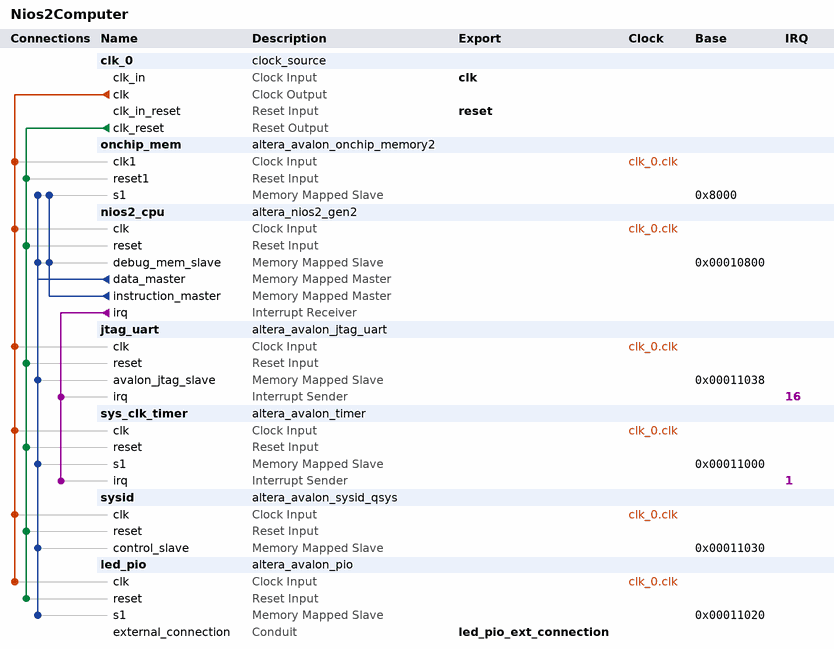
[diagram p0: system contents]
# Platform Designer (Qsys) system Nios2Computer, Cyclone V 5CSEMA4U23C6
# Parameters at their usual value, and those the tool derives, are not listed.
package require -exact qsys 18.1
create_system Nios2Computer
set_project_property DEVICE_FAMILY {Cyclone V}
set_project_property DEVICE 5CSEMA4U23C6

add_instance clk_0 clock_source 18.1
set_instance_parameter_value clk_0 clockFrequency 50000000

add_instance onchip_mem altera_avalon_onchip_memory2 18.1
set_instance_parameter_value onchip_mem dataWidth 32
set_instance_parameter_value onchip_mem dualPort false
set_instance_parameter_value onchip_mem initMemContent true
set_instance_parameter_value onchip_mem initializationFileName onchip_mem.hex
set_instance_parameter_value onchip_mem memorySize 20480

add_instance nios2_cpu altera_nios2_gen2 18.1
set_instance_parameter_value nios2_cpu dcache_size 2048
set_instance_parameter_value nios2_cpu exceptionSlave onchip_mem.s1
set_instance_parameter_value nios2_cpu icache_size 2048
set_instance_parameter_value nios2_cpu impl Fast
set_instance_parameter_value nios2_cpu resetSlave onchip_mem.s1

add_instance jtag_uart altera_avalon_jtag_uart 18.1
set_instance_parameter_value jtag_uart simInteractiveOptions NO_INTERACTIVE_WINDOWS

add_instance sys_clk_timer altera_avalon_timer 18.1
set_instance_parameter_value sys_clk_timer period 1
set_instance_parameter_value sys_clk_timer periodUnits MSEC

add_instance sysid altera_avalon_sysid_qsys 18.1
set_instance_parameter_value sysid id 0

add_instance led_pio altera_avalon_pio 18.1
set_instance_parameter_value led_pio direction Output
set_instance_parameter_value led_pio width 8

# connections
add_connection clk_0.clk jtag_uart.clk clock
add_connection clk_0.clk led_pio.clk clock
add_connection clk_0.clk nios2_cpu.clk clock
add_connection clk_0.clk onchip_mem.clk1 clock
add_connection clk_0.clk sys_clk_timer.clk clock
add_connection clk_0.clk sysid.clk clock
add_connection clk_0.clk_reset jtag_uart.reset reset
add_connection clk_0.clk_reset led_pio.reset reset
add_connection clk_0.clk_reset nios2_cpu.reset reset
add_connection clk_0.clk_reset onchip_mem.reset1 reset
add_connection clk_0.clk_reset sys_clk_timer.reset reset
add_connection clk_0.clk_reset sysid.reset reset
add_connection nios2_cpu.data_master jtag_uart.avalon_jtag_slave avalon
set_connection_parameter_value nios2_cpu.data_master/jtag_uart.avalon_jtag_slave baseAddress 0x00011038
add_connection nios2_cpu.data_master led_pio.s1 avalon
set_connection_parameter_value nios2_cpu.data_master/led_pio.s1 baseAddress 0x00011020
add_connection nios2_cpu.data_master nios2_cpu.debug_mem_slave avalon
set_connection_parameter_value nios2_cpu.data_master/nios2_cpu.debug_mem_slave baseAddress 0x00010800
add_connection nios2_cpu.data_master onchip_mem.s1 avalon
set_connection_parameter_value nios2_cpu.data_master/onchip_mem.s1 baseAddress 0x8000
add_connection nios2_cpu.data_master sys_clk_timer.s1 avalon
set_connection_parameter_value nios2_cpu.data_master/sys_clk_timer.s1 baseAddress 0x00011000
add_connection nios2_cpu.data_master sysid.control_slave avalon
set_connection_parameter_value nios2_cpu.data_master/sysid.control_slave baseAddress 0x00011030
add_connection nios2_cpu.instruction_master nios2_cpu.debug_mem_slave avalon
set_connection_parameter_value nios2_cpu.instruction_master/nios2_cpu.debug_mem_slave baseAddress 0x00010800
add_connection nios2_cpu.instruction_master onchip_mem.s1 avalon
set_connection_parameter_value nios2_cpu.instruction_master/onchip_mem.s1 baseAddress 0x8000
add_connection nios2_cpu.irq jtag_uart.irq interrupt
set_connection_parameter_value nios2_cpu.irq/jtag_uart.irq irqNumber 16
add_connection nios2_cpu.irq sys_clk_timer.irq interrupt
set_connection_parameter_value nios2_cpu.irq/sys_clk_timer.irq irqNumber 1

# exported interfaces
add_interface clk clock sink
set_interface_property clk EXPORT_OF clk_0.clk_in
add_interface led_pio_ext_connection conduit end
set_interface_property led_pio_ext_connection EXPORT_OF led_pio.external_connection
add_interface reset reset sink
set_interface_property reset EXPORT_OF clk_0.clk_in_reset

set_interconnect_requirement {$system} qsys_mm.clockCrossingAdapter HANDSHAKE
set_interconnect_requirement {$system} qsys_mm.enableEccProtection FALSE
set_interconnect_requirement {$system} qsys_mm.insertDefaultSlave FALSE
set_interconnect_requirement {$system} qsys_mm.maxAdditionalLatency 1

save_system Nios2Computer.qsys
